# Altium schematic sheet uart.SchDoc
size A; SheetNumber: 3; SheetTotal: 3
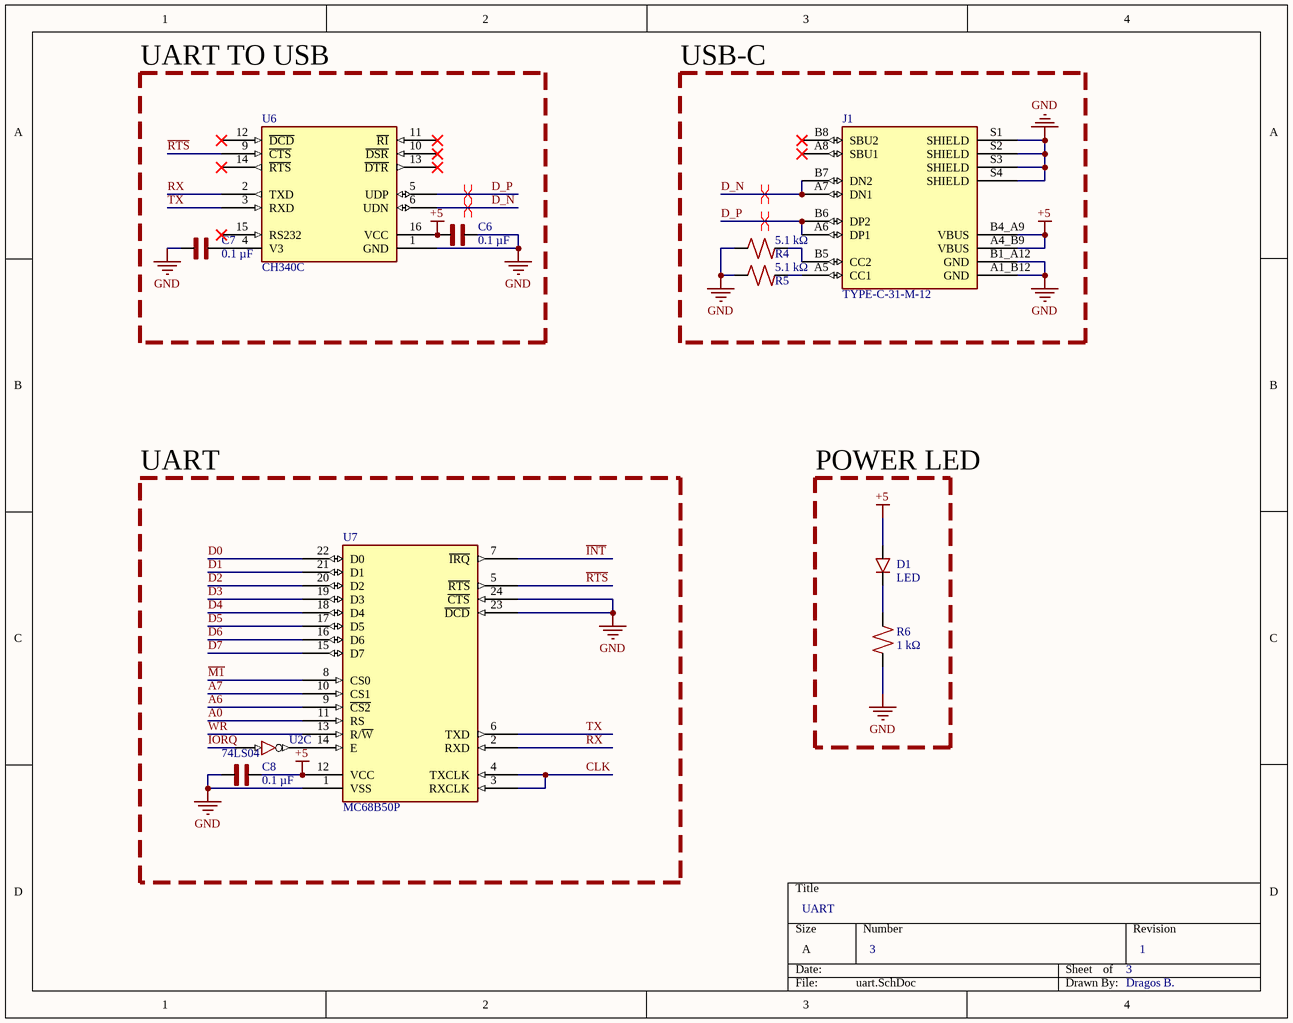
[diagram p0: uart.SchDoc]

## Parts
C6  0.1 µF  [Capacitor]
C7  0.1 µF  [Capacitor]
C8  0.1 µF  [Capacitor]
D1  LED  [DIODE]
J1  TYPE-C-31-M-12  [HRO_TYPE-C-31-M-12]
R4  5.1 kΩ  [Axial 0.4]
R5  5.1 kΩ  [Axial 0.4]
R6  1 kΩ  [Axial 0.4]
U2  74LS04  [DIP14]  (part C of 7)
U6  CH340C  [SOP127P600X175-16M]
U7  MC68B50P  [DIP24]

## Blocks framed on the sheet
UART TO USB: C6 C7 U6
USB-C: J1 R4 R5
UART: C8 U2 U7
POWER LED: D1 R6

## Nets
+5: C6.2 C8.1 D1.A J1.A4_B9(VBUS) J1.B4_A9(VBUS) U6.16(VCC) U7.12(VCC)
GND: C6.1 C7.2 C8.2 J1.A1_B12(GND) J1.B1_A12(GND) J1.S1(SHIELD) J1.S2(SHIELD) J1.S3(SHIELD) J1.S4(SHIELD) R4.1 R5.1 R6.1 U6.1(GND) U7.1(VSS) U7.23(~{DCD}) U7.24(~{CTS})
~{INT}: U7.7(~{IRQ})
~{IORQ}: U2.5(A3)
~{M1}: U7.8(CS0)
~{RTS}: U6.9(~{CTS}) U7.5(~{RTS})
~{WR}: U7.13(R/~{W})
A0: U7.11(RS)
A6: U7.9(~{CS2})
A7: U7.10(CS1)
CLK: U7.3(RXCLK) U7.4(TXCLK)
D0: U7.22(D0)
D1: U7.21(D1)
D2: U7.20(D2)
D3: U7.19(D3)
D4: U7.18(D4)
D5: U7.17(D5)
D6: U7.16(D6)
D7: U7.15(D7)
D_N: J1.A7(DN1) J1.B7(DN2) U6.6(UDN)
D_P: J1.A6(DP1) J1.B6(DP2) U6.5(UDP)
RX: U6.2(TXD) U7.2(RXD)
TX: U6.3(RXD) U7.6(TXD)
NetC7_1: C7.1 U6.4(V3)
NetD1_K: D1.K R6.2
NetJ1_A5: J1.A5(CC1) R5.2
NetJ1_B5: J1.B5(CC2) R4.2
NetU2_6: U2.6(Y3) U7.14(E)

Not connected (* = marked no-connect by the designer): J1 A8(SBU1)* B8(SBU2)*; U6 10(~{DSR})* 11(~{RI})* 12(~{DCD})* 13(~{DTR})* 14(~{RTS})* 15(RS232)*

## Layout directives
differential pair: D_N, D_P

## Notes on the sheet
- UART
- 3
- 1
- Dragos B.

## Library data of the parts
C6-C8 = CAPACITOR: MP: ECWFG70105K; MF: Panasonic; SnapEDA_Link: https://www.snapeda.com/parts/ECWFG70105K/Panasonic/view-part/?ref=snap; Availability: In Stock; Price: None; Check_prices: https://www.snapeda.com/parts/ECWFG70105K/Panasonic/view-part/?ref=eda; Value: *; Purchase-URL: https://pricing.snapeda.com/search/part/ECWFG70105K/?ref=eda; Package: MOLDED-2 Panasonic
J1 = TYPE-C-31-M-12: MF: HRO Electronics Co., Ltd.; SnapEDA_Link: https://www.snapeda.com/parts/TYPE-C-31-M-12/HRO+Electronics+Co.%252C+Ltd./view-part/?ref=snap; Package: Package; Value: *; MP: TYPE-C-31-M-12; Check_prices: https://www.snapeda.com/parts/TYPE-C-31-M-12/HRO+Electronics+Co.%252C+Ltd./view-part/?ref=eda
R4-R6 = RESISTOR: MP: ERJU01J131C; Package: None; Availability: Unavailable; Value: *; Price: None
U2 = 74LS04: Hex Inverters